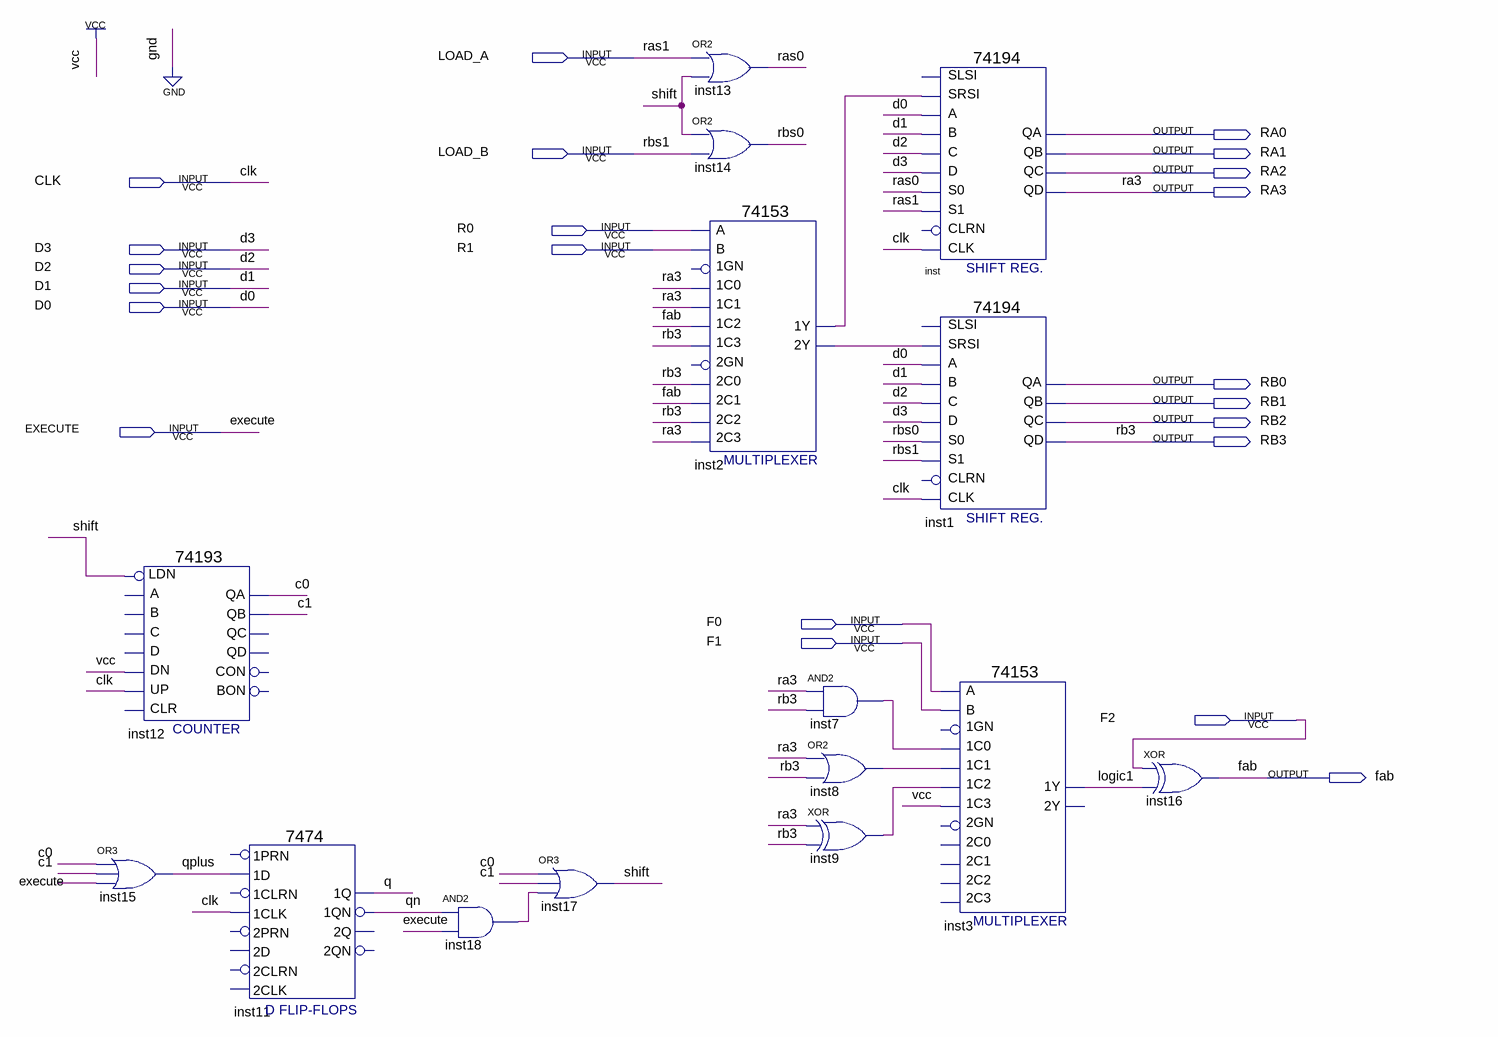
[diagram p0: schematic sheet]
// Quartus schematic lab3.bdf as structural Verilog: 15 symbols, 22 pins
module lab3 (
  input  LOAD_A,
  input  LOAD_B,
  input  CLK,
  input  R0,
  input  D3,
  input  R1,
  input  D2,
  input  D1,
  input  D0,
  input  EXECUTE,
  input  F0,
  input  F1,
  input  F2,
  output RA0,
  output RA1,
  output RA2,
  output RA3,
  output RB0,
  output RB1,
  output RB2,
  output RB3,
  output fab
);

  wire c0, c1, inst2_1y, inst2_2y, inst7_out, inst8_out, inst9_out, inst18_out, logic1, q, qn, qplus, ras0,
       rbs0, shift;

  \74193  inst12 (.UP(CLK), .DN(1'b1), .LDN(shift), .QB(c1), .QA(c0));  // open: D, C, B, A, CLR, CON, QD, QC, BON
  or inst15 (qplus, c0, c1, EXECUTE);
  \7474  inst11 (
    .\1CLK (CLK), .\1D (qplus), .\1QN (qn), .\1Q (q));  // open: 2D, 2PRN, 1PRN, 2CLK, 2CLRN, 1CLRN, 2Q, 2QN
  and inst18 (inst18_out, qn, EXECUTE);
  or inst17 (shift, c0, c1, inst18_out);
  or inst13 (ras0, LOAD_A, shift);
  or inst14 (rbs0, shift, LOAD_B);
  \74153  inst2 (
    .\1C1 (RA3), .\1C0 (RA3), .\2C0 (RB3), .\2C2 (RB3), .\1C2 (fab), .\1C3 (RB3), .B(R1), .A(R0),
    .\2C1 (fab), .\2C3 (RA3), .\1Y (inst2_1y), .\2Y (inst2_2y));  // open: 1GN, 2GN
  and inst7 (inst7_out, RA3, RB3);
  or inst8 (inst8_out, RA3, RB3);
  xor inst9 (inst9_out, RA3, RB3);
  \74194  inst (
    .SRSI(inst2_1y), .B(D1), .C(D2), .CLK(CLK), .D(D3), .S1(LOAD_A), .S0(ras0), .A(D0), .QA(RA0), .QB(RA1),
    .QC(RA2), .QD(RA3));  // open: SLSI, CLRN
  \74194  inst1 (
    .SRSI(inst2_2y), .B(D1), .C(D2), .CLK(CLK), .D(D3), .S1(LOAD_B), .S0(rbs0), .A(D0), .QA(RB0), .QB(RB1),
    .QC(RB2), .QD(RB3));  // open: SLSI, CLRN
  \74153  inst3 (
    .\1C1 (inst8_out), .\1C0 (inst7_out), .\1C2 (inst9_out), .\1C3 (1'b1), .B(F1), .A(F0), .\1Y (logic1));  // open: 1GN, 2C0, 2GN, 2C2, 2C1, 2C3, 2Y
  xor inst16 (fab, F2, logic1);

  // Other names for the same wires on the sheet: ras1 = LOAD_A; rbs1 = LOAD_B
endmodule
